# EAGLE schematic lights_switch_one (EAGLE 7.5.0)
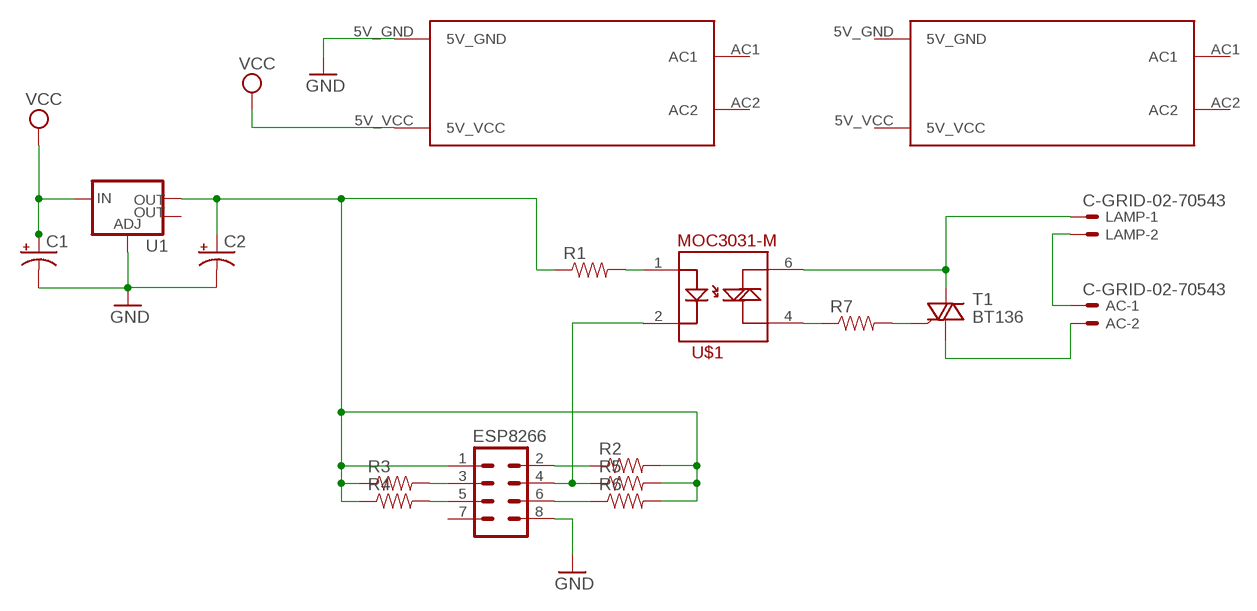
[diagram p0: schematic, sheet 1]

## Parts
AC  C-GRID-02-70543  [70543-02]
C1  CAP_POL1206  [EIA3216]
C2  CAP_POL1206  [EIA3216]
ESP8266  M04X2  [2X4]
LAMP  C-GRID-02-70543  [70543-02]
R1  RESISTOR1206  [1206]
R2  RESISTOR1206  [1206]
R3  RESISTOR1206  [1206]
R4  RESISTOR1206  [1206]
R5  RESISTOR1206  [1206]
R6  RESISTOR1206  [1206]
R7  RESISTOR1206  [1206]
T1  BT136  [TO220AB]
U1  V_REG_LM1117SOT223  [SOT223]
U$1  MOC3031-M  [DIL06]
U$2  HI-LINK5V-ACDC  [AC5V]
U$3  HI-LINK5V-ACDC  [AC5V]

## Nets
GND: C1.C(-) C2.C(-) ESP8266.8 U1.1(ADJ) U$2.5V_GND
N$2: ESP8266.3 R3.2
N$3: ESP8266.5 R4.2
N$4: ESP8266.2 R2.1
N$5: ESP8266.4 R5.1 U$1.2
N$6: ESP8266.6 R6.1
N$7: R1.2 U$1.1
N$8: R7.1 U$1.4
N$9: R7.2 T1.3(G)
N$10: AC.2 T1.1(A1)
N$11: AC.1 LAMP.2
N$12: LAMP.1 T1.2(A2) U$1.6
N$15: C2.A(+) ESP8266.1 R1.1 R2.2 R3.1 R4.1 R5.2 R6.2 U1.2(OUT)
VCC: C1.A(+) U1.3(IN) U$2.5V_VCC
Unconnected: ESP8266.7 U1.4(OUT) U$2.AC1 U$2.AC2 U$3.5V_GND U$3.5V_VCC U$3.AC1 U$3.AC2

## Library data of the parts
AC LAMP = con-molex:C-GRID-02: CONNECTOR wire to board 2.54 mm (0.100") pitch header; OC_FARNELL: unknown; OC_NEWARK: unknown
C1 C2 = SparkFun-Capacitors:CAP_POL: Capacitor Polarized These are standard SMD and PTH capacitors. Normally 10uF, 47uF, and 100uF in electrolytic and tantalum varieties. Always verify the external diameter of the through hole cap, it varies with capacity, voltage, and manufacturer. The EIA devices should be standard.
ESP8266 = SparkFun-Connectors:M04X2: .1" header, two rows of four.
R1-R7 = SparkFun-Resistors:RESISTOR: Resistor Basic schematic elements and footprints for 0603, 1206, and PTH resistors.
T1 = triac:BT136: Triac BT136 series E sensitive gate Source: http://www.nxp.com/acrobat_download/datasheets/BT136_SERIES_E_2.pdf
U1 = SparkFun-PowerIC:V_REG_LM1117: Voltage Regulator LM1117 Standard adjustable voltage regulator but in SMD form. Spark Fun Electronics SKU : COM-00595; PROD_ID: VREG-08170
U$1 = SparkFun-DiscreteSemi:MOC3031-M: Opto-isolated TRIAC
U$2 U$3 = myblog_library:HI-LINK5V-ACDC

## Net classes
0 default: width 0.508 mm, clearance 1.016 mm